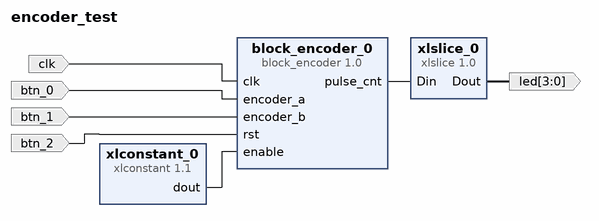
[diagram p0: block diagram of the top level]
# Vivado block design encoder_test, xc7z020clg400-1, Vivado 2023.2
create_bd_design encoder_test

create_bd_port -dir I clk
create_bd_port -dir O -from 3 -to 0 led
create_bd_port -dir I btn_0
create_bd_port -dir I btn_1
create_bd_port -dir I btn_2

create_bd_cell -type ip -vlnv user.org:user:block_encoder:1.0 block_encoder_0
create_bd_cell -type ip -vlnv xilinx.com:ip:xlconstant:1.1 xlconstant_0
create_bd_cell -type ip -vlnv xilinx.com:ip:xlslice:1.0 xlslice_0
set_property -dict {CONFIG.DIN_FROM 3 CONFIG.DIN_WIDTH 9} [get_bd_cells xlslice_0]

# ---- connections ----

connect_bd_net [get_bd_pins block_encoder_0/pulse_cnt] [get_bd_pins xlslice_0/Din]
connect_bd_net -net clk_0_1 [get_bd_ports clk] [get_bd_pins block_encoder_0/clk]
connect_bd_net -net encoder_a_0_1 [get_bd_ports btn_0] [get_bd_pins block_encoder_0/encoder_a]
connect_bd_net -net encoder_b_0_1 [get_bd_ports btn_1] [get_bd_pins block_encoder_0/encoder_b]
connect_bd_net -net rst_0_1 [get_bd_ports btn_2] [get_bd_pins block_encoder_0/rst]
connect_bd_net [get_bd_pins xlconstant_0/dout] [get_bd_pins block_encoder_0/enable]
connect_bd_net [get_bd_pins xlslice_0/Dout] [get_bd_ports led]

validate_bd_design
save_bd_design
